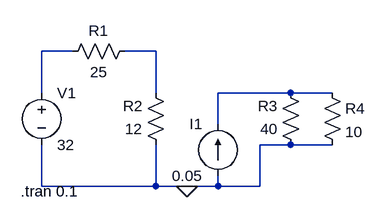
[diagram p0: schematic Draft11.asc]
Draft11.asc, the LTspice schematic file:
Version 4
SHEET 1 880 680
WIRE 64 64 16 64
WIRE 192 64 144 64
WIRE 16 128 16 64
WIRE 192 128 192 64
WIRE 400 128 288 128
WIRE 464 128 400 128
WIRE 288 176 288 128
WIRE 400 208 352 208
WIRE 464 208 400 208
WIRE 16 272 16 208
WIRE 192 272 192 208
WIRE 192 272 16 272
WIRE 240 272 192 272
WIRE 288 272 288 256
WIRE 288 272 240 272
WIRE 352 272 352 208
WIRE 352 272 288 272
FLAG 240 272 0
SYMBOL voltage 16 112 R0
SYMATTR InstName V1
SYMATTR Value 32
SYMBOL res 160 48 R90
WINDOW 0 0 56 VBottom 2
WINDOW 3 32 56 VTop 2
SYMATTR InstName R1
SYMATTR Value 25
SYMBOL res 208 224 R180
WINDOW 0 36 76 Left 2
WINDOW 3 36 40 Left 2
SYMATTR InstName R2
SYMATTR Value 12
SYMBOL res 416 224 R180
WINDOW 0 36 76 Left 2
WINDOW 3 36 40 Left 2
SYMATTR InstName R3
SYMATTR Value 40
SYMBOL res 448 112 R0
SYMATTR InstName R4
SYMATTR Value 10
SYMBOL current 288 256 R180
WINDOW 0 24 80 Left 2
WINDOW 3 24 0 Left 2
SYMATTR InstName I1
SYMATTR Value 0.05
TEXT -16 280 Left 2 !.tran 0.1

The netlist it stands for:
* Draft11.asc
V1 N001 0 32
R1 N002 N001 25
R2 0 N002 12
R3 0 N003 40
R4 N003 0 10
I1 0 N003 0.05
.tran 0.1
.backanno
.end